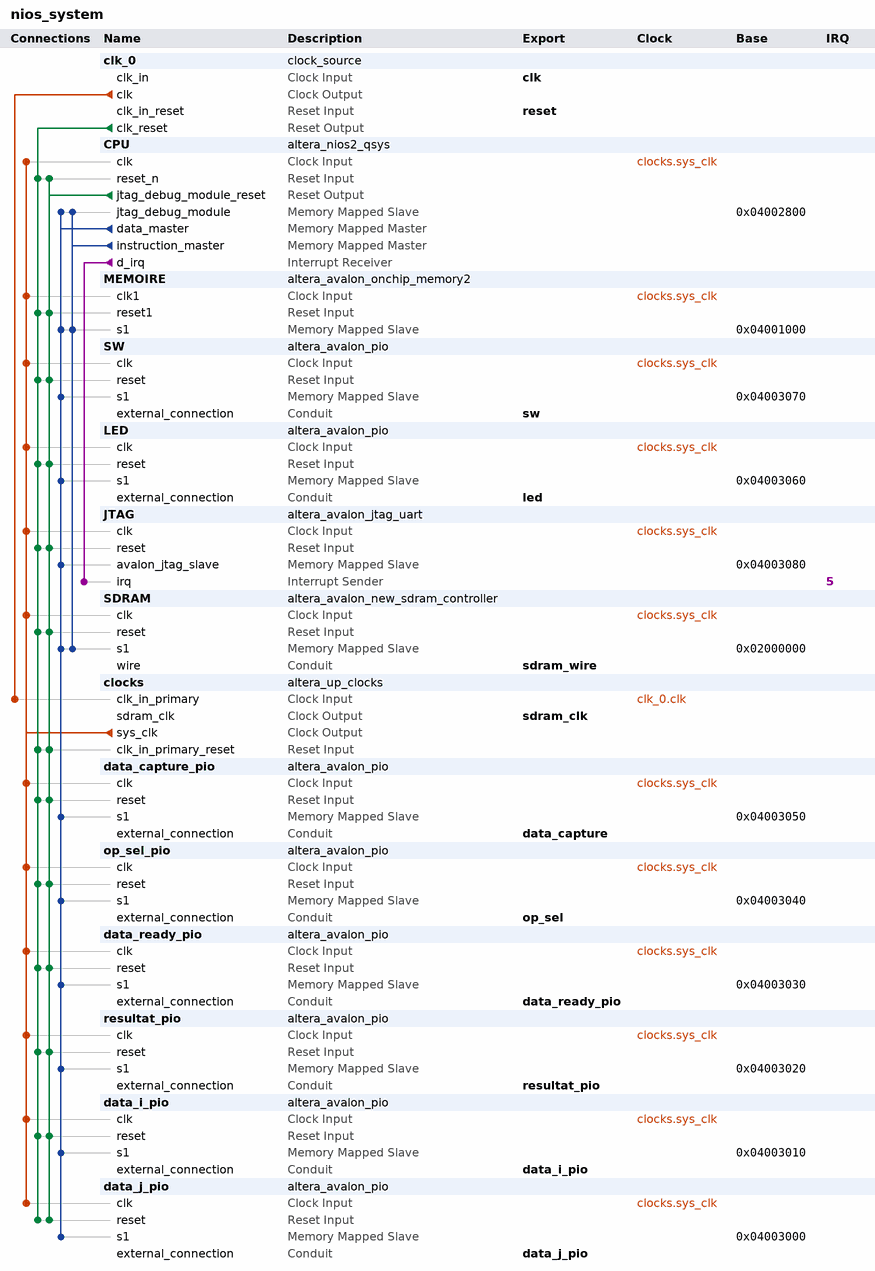
[diagram p0: system contents]
# Platform Designer (Qsys) system nios_system, Cyclone IV GX Unknown
# Parameters at their usual value, and those the tool derives, are not listed.
package require -exact qsys 13.0.1.99.2
create_system nios_system
set_project_property DEVICE_FAMILY {Cyclone IV GX}
set_project_property DEVICE Unknown

add_instance clk_0 clock_source 13.0
set_instance_parameter_value clk_0 clockFrequency 50000000

add_instance CPU altera_nios2_qsys 13.0
set_instance_parameter_value CPU resetSlave SDRAM.s1
set_instance_parameter_value CPU mmu_TLBMissExcSlave None
set_instance_parameter_value CPU exceptionSlave SDRAM.s1
set_instance_parameter_value CPU breakSlave CPU.jtag_debug_module
set_instance_parameter_value CPU impl Tiny
set_instance_parameter_value CPU icache_size 4096

add_instance MEMOIRE altera_avalon_onchip_memory2 13.0.1.99.2
set_instance_parameter_value MEMOIRE dataWidth 32
set_instance_parameter_value MEMOIRE dualPort false
set_instance_parameter_value MEMOIRE initMemContent true
set_instance_parameter_value MEMOIRE initializationFileName onchip_mem.hex
set_instance_parameter_value MEMOIRE memorySize 4096

add_instance SW altera_avalon_pio 13.0.1.99.2
set_instance_parameter_value SW direction Input
set_instance_parameter_value SW width 8

add_instance LED altera_avalon_pio 13.0.1.99.2
set_instance_parameter_value LED direction Output
set_instance_parameter_value LED width 8

add_instance JTAG altera_avalon_jtag_uart 13.0.1.99.2
set_instance_parameter_value JTAG simInteractiveOptions NO_INTERACTIVE_WINDOWS

add_instance SDRAM altera_avalon_new_sdram_controller 13.0.1.99.2
set_instance_parameter_value SDRAM TAC 5.5
set_instance_parameter_value SDRAM TRCD 20.0
set_instance_parameter_value SDRAM TRP 20.0
set_instance_parameter_value SDRAM casLatency 3
set_instance_parameter_value SDRAM columnWidth 9
set_instance_parameter_value SDRAM dataWidth 16
set_instance_parameter_value SDRAM generateSimulationModel false
set_instance_parameter_value SDRAM model single_Micron_MT48LC4M32B2_7_chip
set_instance_parameter_value SDRAM numberOfBanks 4
set_instance_parameter_value SDRAM numberOfChipSelects 1
set_instance_parameter_value SDRAM powerUpDelay 100.0
set_instance_parameter_value SDRAM refreshPeriod 15.625
set_instance_parameter_value SDRAM rowWidth 13

add_instance clocks altera_up_clocks 13.0
set_instance_parameter_value clocks board DE0-Nano
set_instance_parameter_value clocks vga_clk false
set_instance_parameter_value clocks audio_clk true
set_instance_parameter_value clocks audio_clk_freq 12.288

add_instance data_capture_pio altera_avalon_pio 13.0.1.99.2
set_instance_parameter_value data_capture_pio direction Output
set_instance_parameter_value data_capture_pio width 1

add_instance op_sel_pio altera_avalon_pio 13.0.1.99.2
set_instance_parameter_value op_sel_pio direction Output
set_instance_parameter_value op_sel_pio width 2

add_instance data_ready_pio altera_avalon_pio 13.0.1.99.2
set_instance_parameter_value data_ready_pio direction Input
set_instance_parameter_value data_ready_pio width 1

add_instance resultat_pio altera_avalon_pio 13.0.1.99.2
set_instance_parameter_value resultat_pio direction Input
set_instance_parameter_value resultat_pio width 9

add_instance data_i_pio altera_avalon_pio 13.0.1.99.2
set_instance_parameter_value data_i_pio direction Input
set_instance_parameter_value data_i_pio width 8

add_instance data_j_pio altera_avalon_pio 13.0.1.99.2
set_instance_parameter_value data_j_pio direction Input
set_instance_parameter_value data_j_pio width 8

# connections
add_connection clk_0.clk clocks.clk_in_primary clock
add_connection clocks.sys_clk CPU.clk clock
add_connection clocks.sys_clk data_capture_pio.clk clock
add_connection clocks.sys_clk data_i_pio.clk clock
add_connection clocks.sys_clk data_j_pio.clk clock
add_connection clocks.sys_clk data_ready_pio.clk clock
add_connection clocks.sys_clk JTAG.clk clock
add_connection clocks.sys_clk LED.clk clock
add_connection clocks.sys_clk MEMOIRE.clk1 clock
add_connection clocks.sys_clk op_sel_pio.clk clock
add_connection clocks.sys_clk resultat_pio.clk clock
add_connection clocks.sys_clk SDRAM.clk clock
add_connection clocks.sys_clk SW.clk clock
add_connection clk_0.clk_reset clocks.clk_in_primary_reset reset
add_connection clk_0.clk_reset CPU.reset_n reset
add_connection clk_0.clk_reset data_capture_pio.reset reset
add_connection clk_0.clk_reset data_i_pio.reset reset
add_connection clk_0.clk_reset data_j_pio.reset reset
add_connection clk_0.clk_reset data_ready_pio.reset reset
add_connection clk_0.clk_reset JTAG.reset reset
add_connection clk_0.clk_reset LED.reset reset
add_connection clk_0.clk_reset MEMOIRE.reset1 reset
add_connection clk_0.clk_reset op_sel_pio.reset reset
add_connection clk_0.clk_reset resultat_pio.reset reset
add_connection clk_0.clk_reset SDRAM.reset reset
add_connection clk_0.clk_reset SW.reset reset
add_connection CPU.jtag_debug_module_reset clocks.clk_in_primary_reset reset
add_connection CPU.jtag_debug_module_reset CPU.reset_n reset
add_connection CPU.jtag_debug_module_reset data_capture_pio.reset reset
add_connection CPU.jtag_debug_module_reset data_i_pio.reset reset
add_connection CPU.jtag_debug_module_reset data_j_pio.reset reset
add_connection CPU.jtag_debug_module_reset data_ready_pio.reset reset
add_connection CPU.jtag_debug_module_reset JTAG.reset reset
add_connection CPU.jtag_debug_module_reset LED.reset reset
add_connection CPU.jtag_debug_module_reset MEMOIRE.reset1 reset
add_connection CPU.jtag_debug_module_reset op_sel_pio.reset reset
add_connection CPU.jtag_debug_module_reset resultat_pio.reset reset
add_connection CPU.jtag_debug_module_reset SDRAM.reset reset
add_connection CPU.jtag_debug_module_reset SW.reset reset
add_connection CPU.data_master CPU.jtag_debug_module avalon
set_connection_parameter_value CPU.data_master/CPU.jtag_debug_module baseAddress 0x04002800
add_connection CPU.data_master data_capture_pio.s1 avalon
set_connection_parameter_value CPU.data_master/data_capture_pio.s1 baseAddress 0x04003050
add_connection CPU.data_master data_i_pio.s1 avalon
set_connection_parameter_value CPU.data_master/data_i_pio.s1 baseAddress 0x04003010
add_connection CPU.data_master data_j_pio.s1 avalon
set_connection_parameter_value CPU.data_master/data_j_pio.s1 baseAddress 0x04003000
add_connection CPU.data_master data_ready_pio.s1 avalon
set_connection_parameter_value CPU.data_master/data_ready_pio.s1 baseAddress 0x04003030
add_connection CPU.data_master JTAG.avalon_jtag_slave avalon
set_connection_parameter_value CPU.data_master/JTAG.avalon_jtag_slave baseAddress 0x04003080
add_connection CPU.data_master LED.s1 avalon
set_connection_parameter_value CPU.data_master/LED.s1 baseAddress 0x04003060
add_connection CPU.data_master MEMOIRE.s1 avalon
set_connection_parameter_value CPU.data_master/MEMOIRE.s1 baseAddress 0x04001000
add_connection CPU.data_master op_sel_pio.s1 avalon
set_connection_parameter_value CPU.data_master/op_sel_pio.s1 baseAddress 0x04003040
add_connection CPU.data_master resultat_pio.s1 avalon
set_connection_parameter_value CPU.data_master/resultat_pio.s1 baseAddress 0x04003020
add_connection CPU.data_master SDRAM.s1 avalon
set_connection_parameter_value CPU.data_master/SDRAM.s1 baseAddress 0x02000000
add_connection CPU.data_master SW.s1 avalon
set_connection_parameter_value CPU.data_master/SW.s1 baseAddress 0x04003070
add_connection CPU.instruction_master CPU.jtag_debug_module avalon
set_connection_parameter_value CPU.instruction_master/CPU.jtag_debug_module baseAddress 0x04002800
add_connection CPU.instruction_master MEMOIRE.s1 avalon
set_connection_parameter_value CPU.instruction_master/MEMOIRE.s1 baseAddress 0x04001000
add_connection CPU.instruction_master SDRAM.s1 avalon
set_connection_parameter_value CPU.instruction_master/SDRAM.s1 baseAddress 0x02000000
add_connection CPU.d_irq JTAG.irq interrupt
set_connection_parameter_value CPU.d_irq/JTAG.irq irqNumber 5

# exported interfaces
add_interface clk clock sink
set_interface_property clk EXPORT_OF clk_0.clk_in
add_interface reset reset sink
set_interface_property reset EXPORT_OF clk_0.clk_in_reset
add_interface led conduit end
set_interface_property led EXPORT_OF LED.external_connection
add_interface sw conduit end
set_interface_property sw EXPORT_OF SW.external_connection
add_interface sdram_wire conduit end
set_interface_property sdram_wire EXPORT_OF SDRAM.wire
add_interface sdram_clk clock source
set_interface_property sdram_clk EXPORT_OF clocks.sdram_clk
add_interface data_capture conduit end
set_interface_property data_capture EXPORT_OF data_capture_pio.external_connection
add_interface op_sel conduit end
set_interface_property op_sel EXPORT_OF op_sel_pio.external_connection
add_interface data_ready_pio conduit end
set_interface_property data_ready_pio EXPORT_OF data_ready_pio.external_connection
add_interface resultat_pio conduit end
set_interface_property resultat_pio EXPORT_OF resultat_pio.external_connection
add_interface data_i_pio conduit end
set_interface_property data_i_pio EXPORT_OF data_i_pio.external_connection
add_interface data_j_pio conduit end
set_interface_property data_j_pio EXPORT_OF data_j_pio.external_connection

set_interconnect_requirement {$system} qsys_mm.clockCrossingAdapter HANDSHAKE
set_interconnect_requirement {$system} qsys_mm.maxAdditionalLatency 1

save_system nios_system.qsys
